# Altium schematic sheet Sensors.SchDoc
size A; SheetNumber: 3; SheetTotal: 5
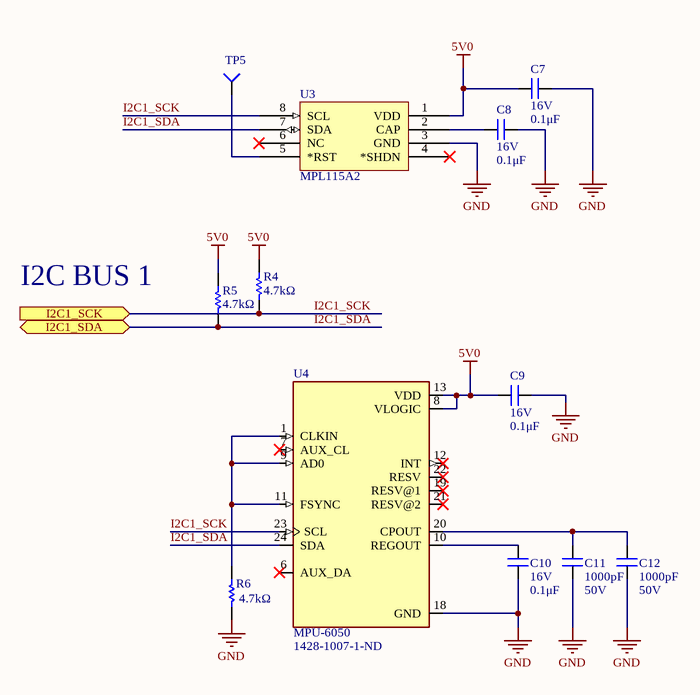
[diagram p0: Sensors.SchDoc]

## Parts
C7  value 0.1μF  Voltage Rating: 16V  [CAP0603]  (hidden comment: CAP_0.1uF_16V_0603)
C8  value 0.1μF  Voltage Rating: 16V  [CAP0603]  (hidden comment: CAP_0.1uF_16V_0603)
C9  value 0.1μF  Voltage Rating: 16V  [CAP0603]  (hidden comment: CAP_0.1uF_16V_0603)
C10  value 0.1μF  Voltage Rating: 16V  [CAP0603]  (hidden comment: CAP_0.1uF_16V_0603)
C11  value 1000pF  Voltage Rating: 50V  [CAP0805]  (hidden comment: CAP_1000pF_50V_0805)
C12  value 1000pF  Voltage Rating: 50V  [CAP0805]  (hidden comment: CAP_1000pF_50V_0805)
R4  value 4.7kΩ  [RES0603]  (hidden comment: RES_4.7kΩ_0603)
R5  value 4.7kΩ  [RES0603]  (hidden comment: RES_4.7kΩ_0603)
R6  value 4.7kΩ  [RES0603]  (hidden comment: RES_4.7kΩ_0603)
TP5  TESTPT  [TESTPT SQUARE]  (value not drawn)
U3  MPL115A2  [LGA8 - MPL115A2]
U4  MPU-6050  Supplier Part Number 1: 1428-1007-1-ND  [QFN50P400X400X95-24N]

## Ports
I2C1_SCK (in), I2C1_SDA (bidir)

## Nets
5V0: C7.2 C9.2 R4.1 R5.1 U3.1(VDD) U4.8(VLOGIC) U4.13(VDD)
GND: C7.1 C8.1 C9.1 C10.1 C11.1 C12.1 R6.2 U3.3(GND) U4.18(GND)
I2C1_SCK: R4.2 U3.8(SCL) U4.23(SCL) ; port I2C1_SCK
I2C1_SDA: R5.2 U3.7(SDA) U4.24(SDA) ; port I2C1_SDA
NetC8_2: C8.2 U3.2(CAP)
NetC10_2: C10.2 U4.10(REGOUT)
NetC11_2: C11.2 C12.2 U4.20(CPOUT)
NetR6_1: R6.1 U4.1(CLKIN) U4.9(AD0) U4.11(FSYNC)
NetTP5_1: TP5.1(=value) U3.5(*RST)

Not connected (* = marked no-connect by the designer): U3 4(*SHDN)* 6(NC)*; U4 6(AUX_DA)* 7(AUX_CL)* 12(INT)* 19(RESV@1)* 21(RESV@2)* 22(RESV)*

## Notes on the sheet
- I2C BUS 1

## Library data of the parts
C7-C10 = CAP_0.1uF_16V_0603: CAP CER 0.1UF 16V X7R 0603; Manufacturer Part Number 1: CC0603KRX7R7BB104; Manufacturer 1: Yageo; Package/Footprint: 0603; Supplier Part Number 1: 311-1088-1-ND; Supplier 1: Digi-Key; Dielectric: X7R
C11 C12 = CAP_1000pF_50V_0805: CAP CER 1000pF 50V X7R 0805; Manufacturer 1: Samsung; Manufacturer Part Number 1: CL21B102KBANNNC; Package/Footprint: 0805; Supplier 1: Digi-Key; Mounting Type: SMD; Supplier Part Number 1: 1276-1020-1-ND; Dielectric: X7R
R4-R6 = RES_4.7kΩ_0603_5%: RES 4.7K OHM 5% 1/10W 0603; Manufacturer 1: Yageo; Manufacturer Part Number 1: RC0603JR-074K7L; Supplier Part Number 1: 311-4.7KGRCT-ND; Supplier 1: Digi-Key
TP5 = TESTPT SQUARE
U3 = MPL115A2: Absolute, 7.25Psi Min, 16.67Psi Max, Rectangular, Surface Mount; Manufacturer: NXP Freescale; MF: NXP USA; Output Type: DIGITAL OUTPUT; Operating Current-Max: 10uA; Output Interface Type: I2C; Port Type: HOLE; Sensors/Transducers Type: PRESSURE SENSOR,PEIZORESISTIVE; Max Supply Voltage: 5.5V; Min Supply Voltage: 2.375V; Body Breadth: 3inch; Body Height: 1.2mm; Body Length or Diameter: 5mm; Availability: Unavailable; SnapEDA_Link: https://www.snapeda.com/parts/MPL115A2/NXP%20USA%20Inc./view-part/494170/?ref=snap; Price: None; MP: MPL115A2; Package: LGA-8 NXP Semiconductors; Value: *; Mouser-Purchase-URL: https://snapeda.com/shop?store=Mouser&id=494170; Supplier 1: Digi-Key; Manufacturer Part Number: MPL115A2; RoHS: Yes; Category: Pressure Sensors; Stock 1: 4480; Pricing 1: 1=7.73000, 5=6.82400, 10=6.02800, 25=5.95800 (USD); Mount: Surface Mount; Package Shape/Style: Rectangular; Min Operating Temperature: -40°C; Max Operating Temperature: 105°C; Pressure Range-Max: 16.67PSI; Pressure Range-Min: 7.25PSI; Pressure Type: Absolute; Termination: Solder; REACH SVHC: Yes; RoHS Compliant: Yes; ComponentLink1URL: https://datasheet.ciiva.com:443/pdfs/VipMasterIC/IC/PHGL/PHGL-S-A0003556458/PHGL-S-A0003556458-1.pdf?src-supplier=IHS+Markit; ComponentLink1Description: https://datasheet.ciiva.com:443/pdfs/VipMasterIC/IC/PHGL/PHGL-S-A0003556458/PHGL-S-A0003556458-1.pdf?src-supplier=IHS+Markit; ComponentLink2URL: https://datasheet.ciiva.com/2843/mpl115a2-2843361.pdf?src-supplier=Digi-Key; ComponentLink2Description: https://datasheet.ciiva.com/2843/mpl115a2-2843361.pdf?src-supplier=Digi-Key; ComponentLink3URL: https://datasheet.ciiva.com/3272/mpl115a2-3272679.pdf?src-supplier=Avnet; ComponentLink3Description: https://datasheet.ciiva.com/3272/mpl115a2-3272679.pdf?src-supplier=Avnet; ComponentLink4URL: https://datasheet.ciiva.com/1578/mpl115a2-1578868.pdf?src-supplier=Farnell; ComponentLink4Description: https://datasheet.ciiva.com/1578/mpl115a2-1578868.pdf?src-supplier=Farnell; ComponentLink5URL: https://datasheet.ciiva.com/26808/getdatasheetpartid-254526-26808246.pdf?src-supplier=Verical; ComponentLink5Description: https://datasheet.ciiva.com/26808/getdatasheetpartid-254526-26808246.pdf?src-supplier=Verical; ComponentLink6URL: https://datasheet.ciiva.com/26023/mpl115a2-26023221.pdf?src-supplier=Avnet+Europe; ComponentLink6Description: https://datasheet.ciiva.com/26023/mpl115a2-26023221.pdf?src-supplier=Avnet+Europe; ComponentLink7URL: https://datasheet.ciiva.com/1513/1789292-1513797.pdf?src-supplier=Element14; ComponentLink7Description: https://datasheet.ciiva.com/1513/1789292-1513797.pdf?src-supplier=Element14; ComponentLink8URL: https://datasheet.ciiva.com/1513/1789292-1513908.pdf?src-supplier=Element14; ComponentLink8Description: https://datasheet.ciiva.com/1513/1789292-1513908.pdf?src-supplier=Element14; Supplier Part Number 1: MPL115A2-ND
U4 = MPU-6050: Analog Circuit, 1 Func, CMOS; MF: TDK InvenSense; Number of Functions: 1; Package Equivalence Code: LCC24,.16SQ,20; Power Supplies: 1.8,2.5/3.3V; Supply Voltage-Max (Vsup): 3.46V; Supply Voltage-Min (Vsup): 2.375V; Supply Voltage-Nom (Vsup): 2.5V; Qualification Status: Not Qualified; Price: None; Package: VFQFN-24 TDK InvenSense; MP: MPU-6050; Value: *; Availability: Unavailable; SnapEDA_Link: https://www.snapeda.com/parts/MPU-6050/TDK%20InvenSense/view-part/4503180/?ref=snap; Supplier 1: Digi-Key; Manufacturer: TDK InvenSense; Manufacturer Part Number: MPU-6050; RoHS: Yes; Category: Inertial Measurement Units (IMUs); Stock 1: 4503; Pricing 1: 1=10.70000, 5=6.95000, 10=6.25500, 25=5.56000, 50=5.14300, 100=4.44800, 500=4.17000, 1000=3.89200 (USD); Package Code: HVQCCN; Number of Pins: 24; Package Shape: Square; Terminal Finish: Nickel; Min Operating Temperature: -40°C; Max Operating Temperature: 85°C; Analog IC - Other Type: ANALOG CIRCUIT; JESD-609 Code: e4; JESD-30 Code: S-XQCC-N24; Package Style: CHIP CARRIER, HEAT SINK/SLUG, VERY THIN PROFILEMeter; Surface Mount: Yes; Technology: CMOS; Terminal Form: No Lead; Terminal Position: QUAD; Moisture Sensitivity Level: 3; Length: 4mm; Width: 4mm; Height - Seated (Max): 0.95mm; Terminal Pitch: 0.5mm; REACH SVHC: No SVHC; RoHS Compliant: Yes; Temperature Grade: INDUSTRIAL; ComponentLink1URL: https://datasheet.ciiva.com:443/pdfs/VipMasterIC/IC/IVNC/IVNCS00058/IVNCS00058-1.pdf?src-supplier=IHS+Markit; ComponentLink1Description: https://datasheet.ciiva.com:443/pdfs/VipMasterIC/IC/IVNC/IVNCS00058/IVNCS00058-1.pdf?src-supplier=IHS+Markit; ComponentLink2URL: https://datasheet.ciiva.com/1513/1788002-1513632.pdf?src-supplier=Element14; ComponentLink2Description: https://datasheet.ciiva.com/1513/1788002-1513632.pdf?src-supplier=Element14; ComponentLink3URL: https://datasheet.ciiva.com/22731/1788002-22731434.pdf?src-supplier=Element14; ComponentLink3Description: https://datasheet.ciiva.com/22731/1788002-22731434.pdf?src-supplier=Element14